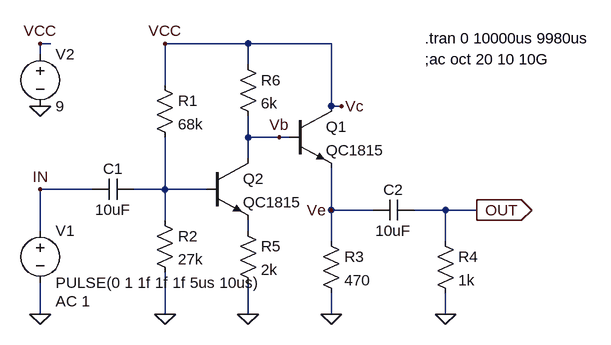
[diagram p0: schematic Emiiter_Common+Emitter_Follwer_Step.asc]
Emiiter_Common+Emitter_Follwer_Step.asc, the LTspice schematic file:
Version 4
SHEET 1 1100 680
WIRE 16 -48 0 -48
WIRE 320 -48 192 -48
WIRE 448 -48 320 -48
WIRE 0 -32 0 -48
WIRE 320 -16 320 -48
WIRE 192 16 192 -48
WIRE 448 48 448 -48
WIRE 464 48 448 48
WIRE 320 96 320 64
WIRE 368 96 320 96
WIRE 384 96 368 96
WIRE 320 128 320 96
WIRE 80 176 0 176
WIRE 192 176 192 96
WIRE 192 176 144 176
WIRE 256 176 192 176
WIRE 448 208 448 144
WIRE 512 208 448 208
WIRE 624 208 576 208
WIRE 672 208 624 208
WIRE 192 224 192 176
WIRE 0 240 0 176
WIRE 320 240 320 224
WIRE 448 256 448 208
WIRE 624 256 624 208
WIRE 0 368 0 320
WIRE 192 368 192 304
WIRE 320 368 320 320
WIRE 448 368 448 336
WIRE 624 368 624 336
FLAG 0 368 0
FLAG 0 48 0
FLAG 0 -48 VCC
FLAG 192 368 0
FLAG 448 368 0
FLAG 672 208 OUT
IOPIN 672 208 Out
FLAG 192 -48 VCC
FLAG 624 368 0
FLAG 0 176 IN
FLAG 368 96 Vb
FLAG 448 208 Ve
FLAG 464 48 Vc
FLAG 320 368 0
SYMBOL npn 384 48 R0
SYMATTR InstName Q1
SYMATTR Value QC1815
SYMBOL voltage 0 224 R0
WINDOW 123 24 124 Left 2
WINDOW 39 24 152 Left 2
SYMATTR Value2 AC 1
SYMATTR InstName V1
SYMATTR Value PULSE(0 1 1f 1f 1f 5us 10us)
SYMBOL cap 144 160 R90
WINDOW 0 0 32 VBottom 2
WINDOW 3 32 32 VTop 2
SYMATTR InstName C1
SYMATTR Value 10uF
SYMBOL voltage 0 -48 R0
WINDOW 123 0 0 Left 2
WINDOW 39 0 0 Left 2
SYMATTR InstName V2
SYMATTR Value 9
SYMBOL res 176 0 R0
SYMATTR InstName R1
SYMATTR Value 68k
SYMBOL res 176 208 R0
SYMATTR InstName R2
SYMATTR Value 27k
SYMBOL res 432 240 R0
SYMATTR InstName R3
SYMATTR Value 470
SYMBOL cap 576 192 R90
WINDOW 0 0 32 VBottom 2
WINDOW 3 32 32 VTop 2
SYMATTR InstName C2
SYMATTR Value 10uF
SYMBOL res 608 240 R0
SYMATTR InstName R4
SYMATTR Value 1k
SYMBOL npn 256 128 R0
SYMATTR InstName Q2
SYMATTR Value QC1815
SYMBOL res 304 224 R0
SYMATTR InstName R5
SYMATTR Value 2k
SYMBOL res 304 -32 R0
SYMATTR InstName R6
SYMATTR Value 6k
TEXT 592 -56 Left 2 !.tran 0 10000us 9980us
TEXT 592 -24 Left 2 !;ac oct 20 10 10G

The netlist it stands for:
* Emiiter_Common+Emitter_Follwer_Step.asc
Q1 Vc Vb Ve 0 QC1815
V1 IN 0 PULSE(0 1 1f 1f 1f 5us 10us) AC 1
C1 N001 IN 10uF
V2 Vc 0 9
R1 Vc N001 68k
R2 N001 0 27k
R3 Ve 0 470
C2 OUT Ve 10uF
R4 OUT 0 1k
Q2 Vb N001 N002 0 QC1815
R5 N002 0 2k
R6 Vc Vb 6k
.model NPN NPN
.model PNP PNP
.lib standard.bjt
.tran 0 10000us 9980us
;ac oct 20 10 10G
.backanno
.end